# EAGLE schematic ColumnDriver (EAGLE 6.3)
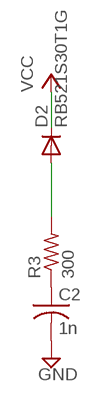
[diagram p0: schematic, sheet 1]

## Parts
C2  1n  C-USC0805  [C0805]
D2  RB521S30T1G  DIODE-SOD523  [SOD523]
R3  300  R-US_R0805  [R0805]

## Nets
GND: C2.2
N$5: D2.A R3.2
N$6: C2.1 R3.1
VCC: D2.C

## Library data of the parts
C2 = resistor:C-US: CAPACITOR, American symbol
D2 = diode:DIODE-: DIODE
R3 = resistor:R-US_: RESISTOR, American symbol